# EAGLE design adc12 (EAGLE 7.2.0)
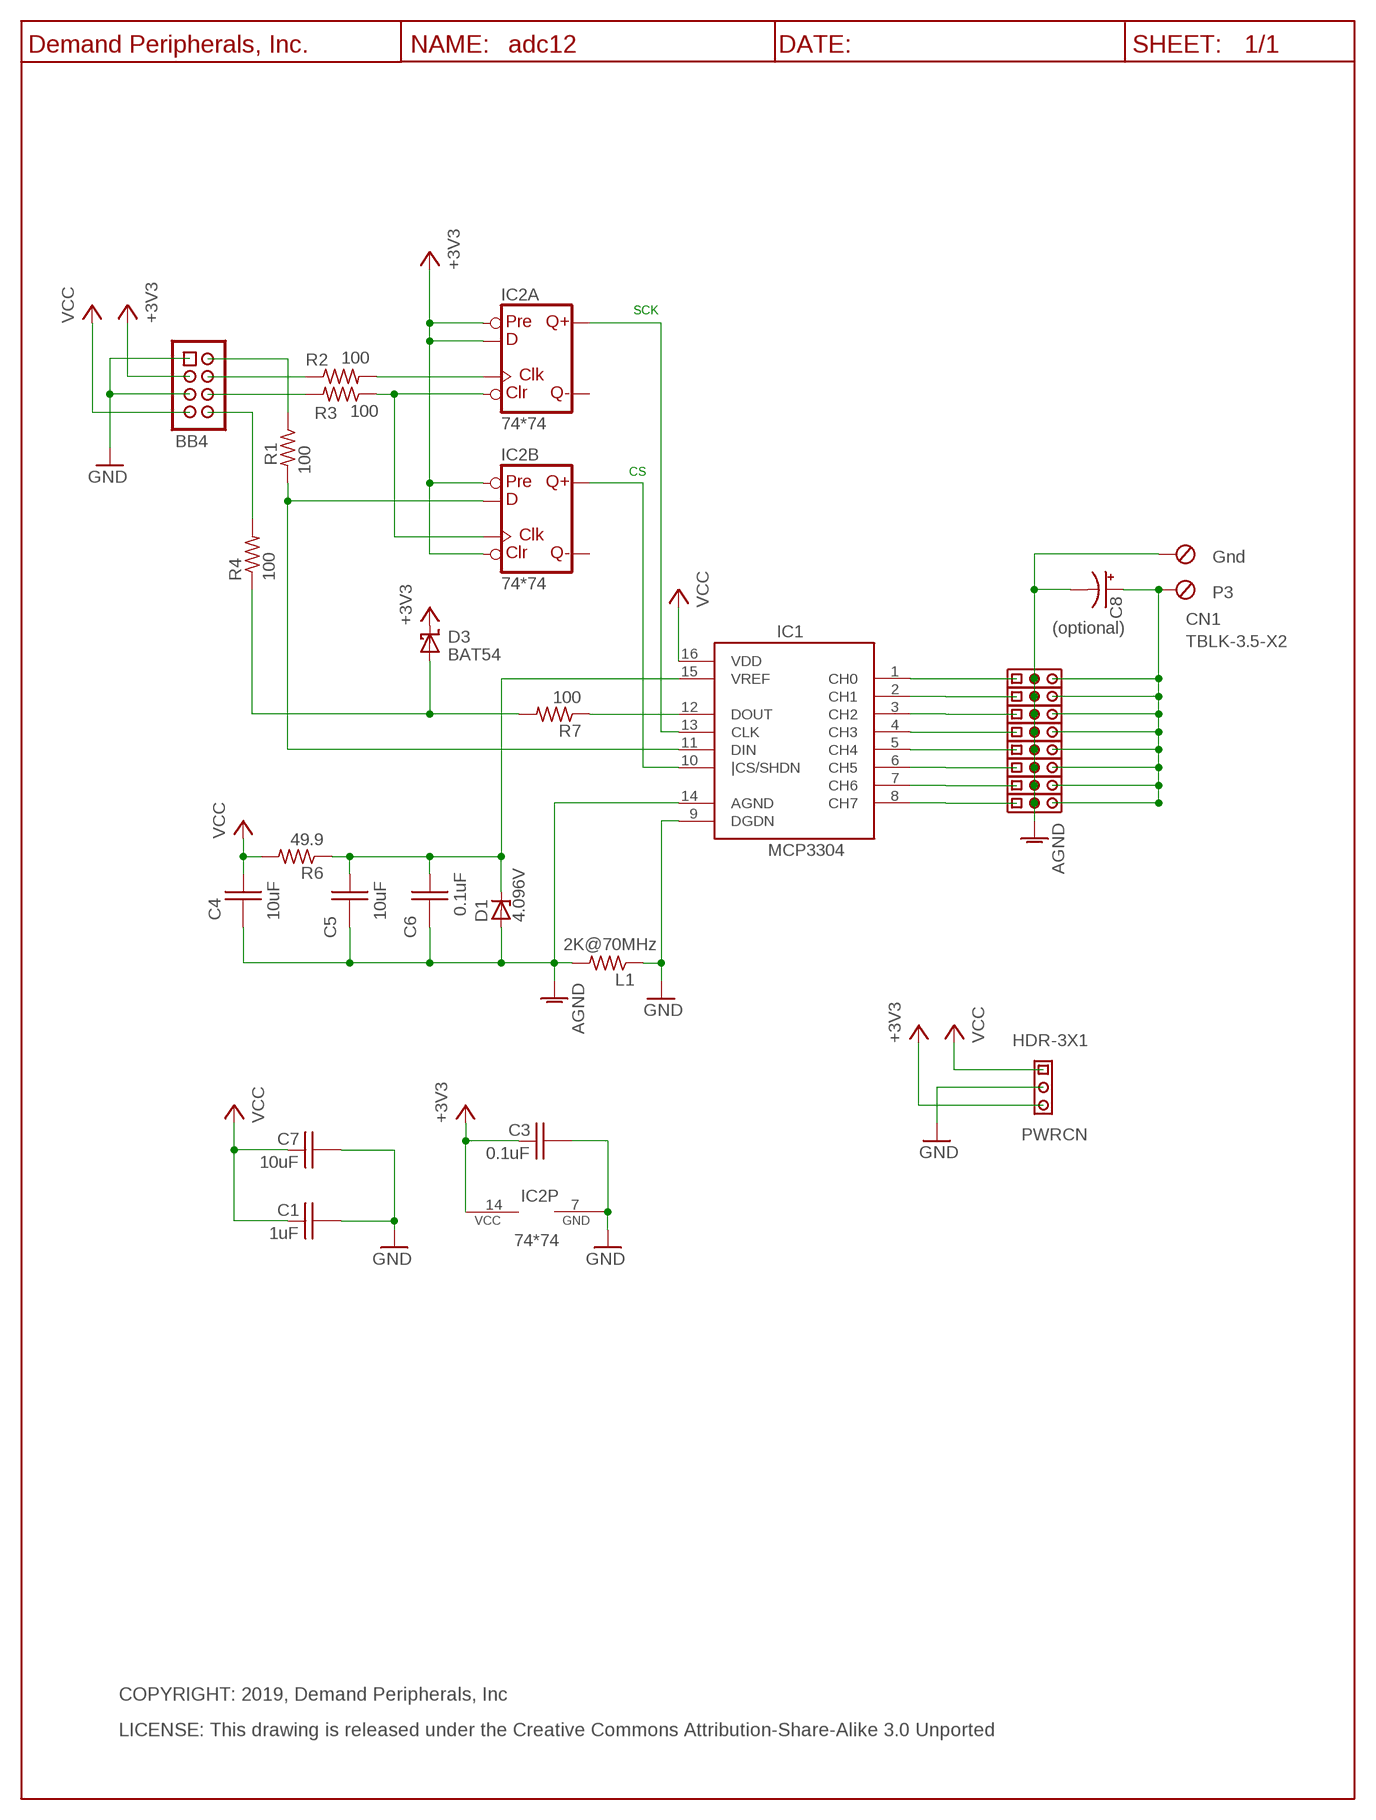
[diagram p0: schematic, sheet 1]

## Parts
BB4  BB4_CON  HDR-4X2-SHR  [HDR-4X2]
C1  1uF  C1.0UF_C0603  [C0603]
C3  0.1uF  C0.1UF_C0603  [C0603]
C4  10uF  C10UF35V_C0805  [C0805]
C5  10uF  C10UF35V_C0805  [C0805]
C6  0.1uF  C0.1UF_C0603  [C0603]
C7  10uF  C10UF35V_C0805  [C0805]
C8  C100UF_E3.5-8  [E3.5-8]
CN1  TBLK-3.5-X2  [TBLK-3.5-X2]
D1  4.096V  LM4040  [SOT23]
D3  BAT54  [SOT23]
IC1  MCP3304  [SO16]
IC2  74*74  74AHC74SS  [SO14]
L1  2K@70MHz  L2K70MHZR0805  [R0805]
PWRCN  HDR-3X1  [HDR-3X1]
R1  100  R100_R0603  [R0603]
R2  100  R100_R0603  [R0603]
R3  100  R100_R0603  [R0603]
R4  100  R100_R0603  [R0603]
R6  49.9  R49.9R0603  [R0603]
R7  100  R100_R0603  [R0603]
U$3  DP_FRAME_P  [LETTER_P]
U$6  HDR-3X1  [HDR-3X1]
U$7  HDR-3X1  [HDR-3X1]
U$8  HDR-3X1  [HDR-3X1]
U$9  HDR-3X1  [HDR-3X1]
U$10  HDR-3X1  [HDR-3X1]
U$11  HDR-3X1  [HDR-3X1]
U$12  HDR-3X1  [HDR-3X1]
U$13  HDR-3X1  [HDR-3X1]

## Nets
+3V3: BB4.3 C3.1 D3.3(CC) IC2.2(A:D) IC2.4(A:PRE) IC2.10(B:PRE) IC2.13(B:CLR) IC2.14(P:VCC) PWRCN.3
AGND: C4.2 C5.2 C6.2 C8.- CN1.1(KL) D1.2(A) IC1.14(AGND) L1.2 U$6.2 U$7.2 U$8.2 U$9.2 U$10.2 U$11.2 U$12.2 U$13.2
GND: BB4.1 BB4.5 C1.2 C3.2 C7.2 IC1.9(DGDN) IC2.7(P:GND) L1.1 PWRCN.2
N$1: C8.+ CN1.2(KL1) U$6.3 U$7.3 U$8.3 U$9.3 U$10.3 U$11.3 U$12.3 U$13.3
N$2: IC1.2(CH1) U$12.1
N$3: IC1.3(CH2) U$11.1
N$4: IC1.4(CH3) U$10.1
N$5: IC1.5(CH4) U$9.1
N$6: IC1.6(CH5) U$8.1
N$7: IC1.7(CH6) U$7.1
N$8: IC1.8(CH7) U$6.1
N$9: IC1.12(DOUT) R7.1
N$10: IC1.1(CH0) U$13.1
N$11: D3.1(A) R4.1 R7.2
N$13: IC2.1(A:CLR) IC2.11(B:CLK) R3.1
N$14: BB4.4 R2.1
N$15: IC1.11(DIN) IC2.12(B:D) R1.2
N$16: IC2.3(A:CLK) R2.2
N$17: IC1.10(|CS/SHDN) IC2.9(B:Q)
N$18: IC1.13(CLK) IC2.5(A:Q)
N$19: BB4.6 R3.2
N$20: BB4.2 R1.1
N$21: BB4.8 R4.2
N$23: C5.1 C6.1 D1.1(C) IC1.15(VREF) R6.1
VCC: BB4.7 C1.1 C4.1 C7.1 IC1.16(VDD) PWRCN.1 R6.2
Unconnected: IC2.6(A:!Q) IC2.8(B:!Q)

## Notes on the sheet
- SCK
- CS
- Gnd
- P3
- (optional)
- COPYRIGHT: 2019, Demand Peripherals, Inc
- LICENSE: This drawing is released under the Creative Commons Attribution-Share-Alike 3.0 Unported

## Library data of the parts
BB4 = dpi-conn:HDR-4X2-SHR: Shrouded 4x2 pin header; VENDOR: Digikey; VENDOR-PART-NUM: 609-3530-ND
C1 = dpi-passive:C1.0UF_: 1.0 uF Capacitor, 25V, Y5V; VENDOR: Digikey; VENDOR-PART-NUM: 490-3897-2-ND
C3 C6 = dpi-passive:C0.1UF_: 0.1 uF Capacitor, 25V, X7R; VENDOR: Digikey; VENDOR-PART-NUM: 1276-1126-2-ND
C4 C5 C7 = dpi-passive:C10UF35V_: 10 uF Capacitor, 35V, X6S; VENDOR: Digikey; VENDOR-PART-NUM: 490-10504-2-ND
C8 = dpi-passive:C100UF_: 100uF polarized capacitor, general purpose; VENDOR: Digikey; VENDOR-PART-NUM: 1572-1044-ND
CN1 = dpi-conn:TBLK-3.5-X2: Terminal Block, 3.5mm, x2, screw terminals; VENDOR: Digikey; VENDOR-PART-NUM: ED2740-ND
D1 = dpi-diopto:LM4040: Zener Diode, 4.096 volts, +/-0.2%; VENDOR: Digikey; VENDOR-PART-NUM: LM4040BIM3-4.1/NOPBCT-ND
D3 = dpi-diopto:BAT54: Schottky Diode; VENDOR: Digikey; VENDOR-PART-NUM: DB3Y313KELCT-ND
IC1 = dpi-transic:MCP3304: 8 channel ADC converter with SPI interface; VENDOR: Digikey; VENDOR-PART-NUM: MCP3304-CI/SL-ND
IC2 = dpi-transic:74AHC74: Dual D type positive edge triggered FLIP FLOP, preset and clear; VENDOR: Digikey; VENDOR-PART-NUM: 568-4458-1-ND
L1 = dpi-passive:L2K70MHZ: Ferrite filter, 2K Ohm at 70MHz; VENDOR: Digikey; VENDOR-PART-NUM: 1276-6330-1-ND
PWRCN U$6-U$13 = dpi-conn:HDR-3X1: 3 pin header on 0.1 inch centers, no shroud, no lock; VENDOR: Digikey; VENDOR-PART-NUM: 952-2264-ND
R1-R4 R7 = dpi-passive:R100_: 100 Ohm resistor, 1%, 0.1 watt; VENDOR: Digikey; VENDOR-PART-NUM: 311-100HRTR-ND
R6 = dpi-passive:R49.9: 49.9 Ohm resistor, 1%, 0.1 watt; VENDOR: Digikey; VENDOR-PART-NUM: 311-49.9HRTR-ND
U$3 = DP:DP_FRAME_P: Portrait/Letter Document Frame

## Board
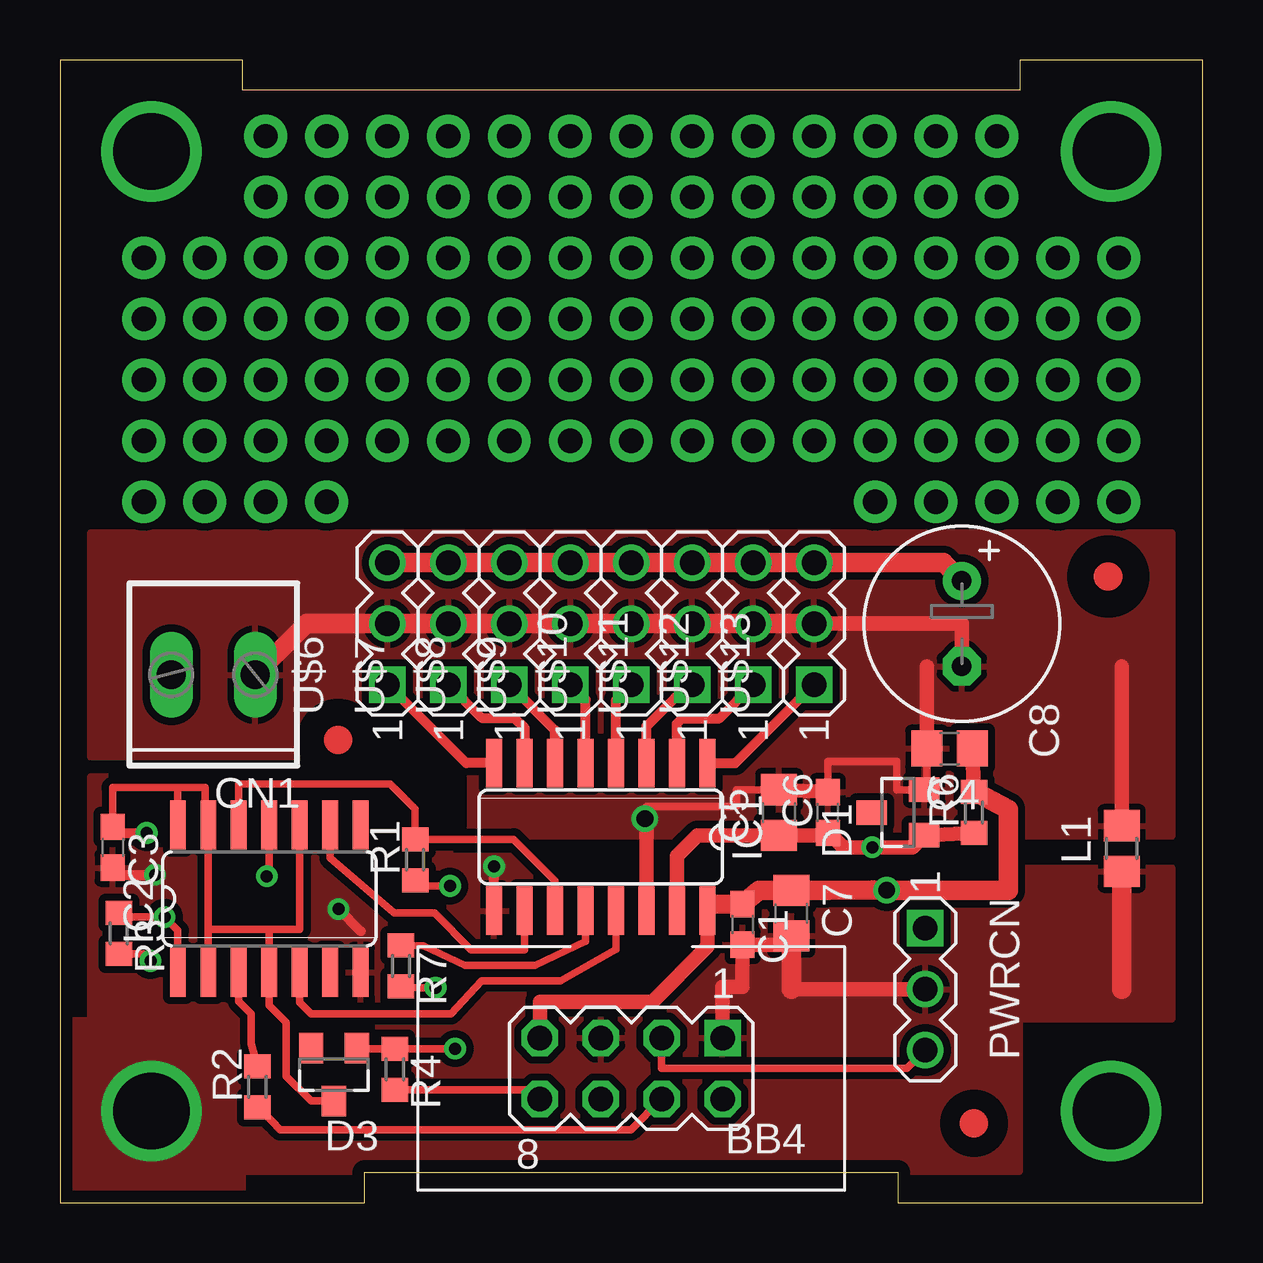
[diagram p1: board, top side]
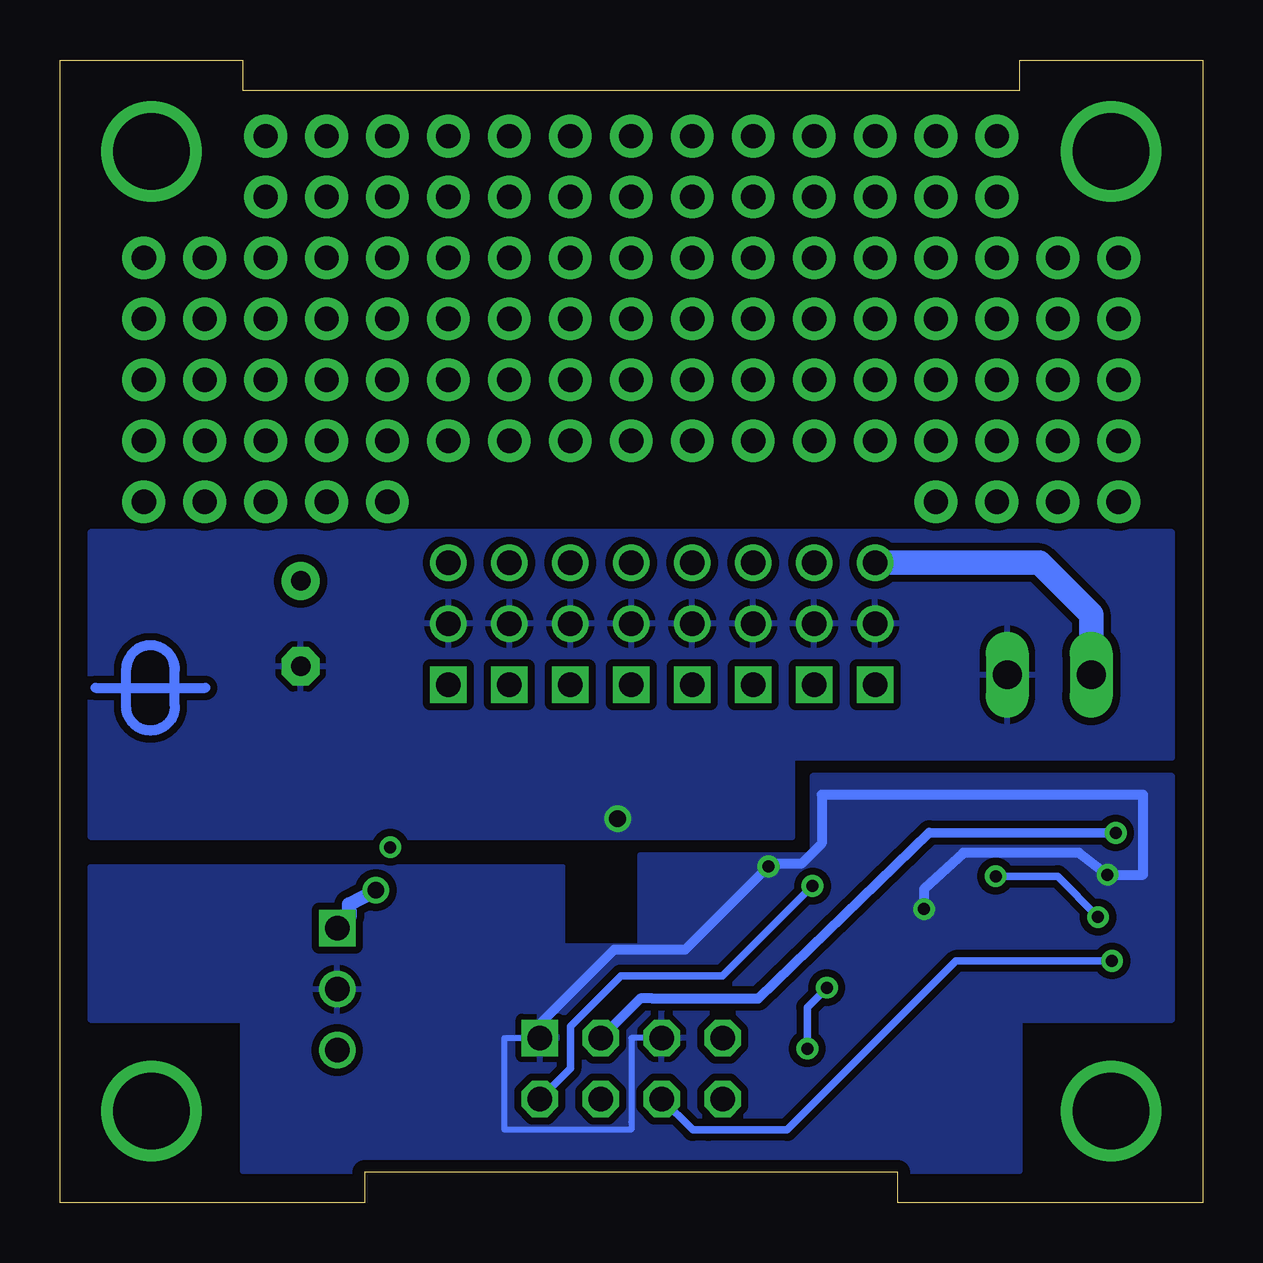
[diagram p2: board, bottom side, seen from below]

Size 47.62 x 47.62 mm. Coordinates in mm from the lower left corner, seen from the top.
Outline: 0,0 12.7,0 12.7,1.27 34.92,1.27 34.92,0 47.62,0 47.62,47.62 40.01,47.62 40.01,46.35 7.62,46.35 7.62,47.62 0,47.62 0,0
Copper layers (1*16): Top 0.035mm / dielectric 1.5mm / Bottom 0.035mm
Design rules "default *": minimum track width 10mil, minimum drill 19mil, track to track 12mil, track to pad 12mil, pad to pad 12mil, via to via 12mil, smd to smd 10mil, copper to edge 20mil, drill to drill 12mil, minimum pad ring 10mil, minimum via ring 8mil, stop-mask expansion 4mil, vias tented up to drill 0mil, thermal gap 10mil
tKeepout: area 15.1,1 to 32.5,9.7

### Footprints (pad centres in the part's own frame; a part is rotated, then mirrored left to right if it is on the bottom)
HDR-4X2 = drill 1.016 square: 1 -3.81,-1.27 | drill 1.016 octagon: 2 -3.81,1.27; 3 -1.27,-1.27; 4 -1.27,1.27; 5 1.27,-1.27; 6 1.27,1.27; 7 3.81,-1.27; 8 3.81,1.27
C0603 = smd 1.1 x 1: 1 -0.85,0; 2 0.85,0
C0805 = smd 1.3 x 1.5: 1 -0.95,0; 2 0.95,0
E3.5-8 = drill 0.813 pad 1.6: + -1.778,0 | drill 0.813 pad 1.6 octagon: - 1.778,0
TBLK-3.5-X2 = drill 1.2 long: 1 -1.75,0; 2 1.75,0
SOT23 = smd 1.016 x 1.27: 1 -0.95,-1.1; 2 0.95,-1.1; 3 0,1.1
SO16 = smd 0.66 x 2.032: 1 -4.445,-3.073; 2 -3.175,-3.073; 3 -1.905,-3.073; 4 -0.635,-3.073; 5 0.635,-3.073; 6 1.905,-3.073; 7 3.175,-3.073; 8 4.445,-3.073; 9 4.445,3.073; 10 3.175,3.073; 11 1.905,3.073; 12 0.635,3.073; 13 -0.635,3.073; 14 -1.905,3.073; 15 -3.175,3.073; 16 -4.445,3.073
SO14 = smd 0.66 x 2.032: 1 -3.81,-3.073; 2 -2.54,-3.073; 3 -1.27,-3.073; 4 0,-3.073; 5 1.27,-3.073; 6 2.54,-3.073; 7 3.81,-3.073; 8 3.81,3.073; 9 2.54,3.073; 10 1.27,3.073; 11 0,3.073; 12 -1.27,3.073; 13 -2.54,3.073; 14 -3.81,3.073
R0805 = smd 1.3 x 1.5: 1 -0.95,0; 2 0.95,0
HDR-3X1 = drill 1.016 square: 1 -2.54,0 | drill 1.016: 2 0,0; 3 2.54,0
R0603 = smd 1 x 1.1: 1 -0.85,0; 2 0.85,0

### Placement (x,y rotation side)
BB4  23.81,5.59 180 top
C1  28.45,11.6 270 top
C3  2.2,14.81 270 top
C4  37.08,18.92 180 top
C5  29.97,16.26 90 top
C6  32,16.26 90 top
C7  30.48,12.06 270 top
C8  37.59,24.13 270 top
CN1  6.39,22 180 top
D1  34.92,16.26 90 top
D3  11.42,5.33 180 top
IC1  22.54,15.24 180 top
IC2  8.72,12.66 0 top
L1  44.26,14.76 90 top
PWRCN  36.07,8.89 270 top
R1  14.81,14.29 90 top
R2  8.23,4.83 90 top
R3  2.45,11.21 270 top
R4  13.96,5.55 270 top
R6  38.1,16.26 90 top
R7  14.21,9.87 270 top
U$1  [DPI-1]  43.85,21.45 90 bottom
U$2  [FIDUCIAL]  11.6,19.28 0 top
U$3  -2.54,-2.54 0 top
U$4  [FIDUCIAL]  43.69,26.09 0 top
U$5  [FIDUCIAL]  38.1,3.3 0 top
U$6  13.65,24.13 90 top
U$7  16.19,24.13 90 top
U$8  18.73,24.13 90 top
U$9  21.27,24.13 90 top
U$10  23.81,24.13 90 top
U$11  26.35,24.13 90 top
U$12  28.89,24.13 90 top
U$13  31.43,24.13 90 top

### Tracks (layer width: path | path; a pad name or v marks a point on that pad's centre or on a via)
+3V3  (via drill 0.5)
  Top 0.305: 8.72,11.39 IC2.4 8.72,8.21 9.42,7.51 9.42,5.27 10.46,4.23 D3.3 | 8.72,11.39 6.18,11.39 | 6.18,11.39 IC2.2 | 6.18,11.39 IC2.13 6.12,15.8 6.06,15.73 6.06,17.3 4.92,17.3 | IC2.10 9.99,11.39 8.72,11.39 | 4.92,17.3 4.84,17.3 | 4.84,17.3 2.2,17.3 C3.1 | IC2.14 4.92,17.3 | 4.92,17.3 4.84,17.3 | PWRCN.3 35.31,5.59 27.06,5.59 25.08,5.59 BB4.3
  Top 0.406: C3.1 2.45,15.4 v3.62,15.4
  Bottom 0.406: v3.62,15.4 11.39,15.42 18.52,8.51 22.92,8.51 23.43,8.51 BB4.3
AGND  (via drill 0.7)
  Top 0.305: C5.2 28.19,17.21 28.19,16.51 24.45,16.51 24.45,15.82 | C4.2 36.13,17.21 D1.2 34.89,17.21 34.89,18.39 32,18.39 C6.2
  Top 0.61: C6.2 C5.2 | 36.13,22.35 C4.2 | 44.26,22.35 L1.2 | 24.45,15.82 IC1.14 | U$13.2 37.59,24.13 C8.-
  Top 0.813: U$13.2 U$12.2 U$11.2 U$10.2 U$9.2 U$8.2 U$7.2 U$6.2 10.27,24.13 CN1.1
  other vias: 24.38,16
  pour Top (isolate 0.305): 46.35,27.94 46.35,15.24 17.09,15.23 17.09,18.54 1.27,18.54 1.27,27.94
  pour Bottom (isolate 0.305): 46.35,27.94 46.35,15.24 17.09,15.23 17.09,18.54 1.27,18.54 1.27,27.94
GND  (via drill 0.5, 3.17)
  Top 0.406: IC1.9 v18.1,14.01 | v11.61,12.23 12.54,11.3 | 2.49,13.66 v3.96,13.66
  Top 0.61: C7.2 30.43,10.73 C1.2 28.45,8.99 27.62,8.99 BB4.1 | PWRCN.2 30.48,8.89
  Top 0.813: C7.2 30.48,8.89 | 44.26,8.89 L1.1
  Bottom 0.254: BB4.5 23.81,6.86 23.81,3.35 23.81,3.04 29.1,3.04 29.1,6.86 BB4.1
  Bottom 0.406: v18.1,14.01 21.57,10.54 24.52,10.54 27.62,7.44 BB4.1 | v11.61,12.23 11.61,13.07 9.97,14.58 5.16,14.58 v3.96,13.66 2.48,13.66 2.48,16.99 15.88,16.99 15.88,14.97 16.73,14.12 17.98,14.12 v18.1,14.01 | 18.1,13.97 v18.1,14.01
  other vias: 3.81,3.81
  pour Bottom (isolate 0.305): 1.27,7.62 1.27,17.78 16.26,17.78 16.26,14.48 23.44,14.48 23.44,10.67 26.67,10.67 26.67,13.97 46.35,13.97 46.35,7.62 40.01,7.62 40.01,1.32 7.62,1.32 7.62,7.62
  pour Top: 1.27,17.78 16.26,17.78 16.26,14.48 23.51,14.48 23.51,10.67 26.67,10.67 26.67,13.97 46.35,13.97 46.35,7.62 40.01,7.62 40.01,1.27 7.62,1.27 7.62,0.51 0.51,0.51 0.51,7.62 1.27,7.62
MOUNT2  (via drill 3.17)
  other vias: 43.81,43.81
MOUNT3  (via drill 3.17)
  other vias: 43.81,3.81
MOUNT4  (via drill 3.17)
  other vias: 3.81,43.81
N$1
  Top 0.813: U$6.3 U$7.3 U$8.3 U$9.3 U$10.3 U$11.3 U$12.3 U$13.3 36.83,26.67 C8.+
  Bottom 1.016: U$6.3 6.81,26.67 4.64,24.5 CN1.2
N$2
  Top 0.406: IC1.2 25.72,19.96 25.93,20.18 27.48,20.18 U$12.1
N$3
  Top 0.406: IC1.3 24.45,19.85 25.65,21.06 26.19,21.59 U$11.1
N$4
  Top 0.406: IC1.4 23.18,20.95 U$10.1
N$5
  Top 0.406: IC1.5 21.91,20.95 U$9.1
N$6
  Top 0.406: IC1.6 20.64,19.68 U$8.1
N$7
  Top 0.406: IC1.7 19.37,19.77 18.94,20.21 17.58,20.21 U$7.1
N$8
  Top 0.406: IC1.8 16.93,18.31 U$6.1
N$9
  Top 0.305: IC1.12 21.91,10.88 19.8,9.88 16.88,9.88 15.15,10.71 R7.1
N$10
  Top 0.406: IC1.1 28.16,18.31 U$13.1
N$11  (via drill 0.5)
  Top 0.305: D3.1 12.4,6.4 R4.1 16.46,6.4 v16.47,6.41 | R7.2 14.9,8.95 v15.66,8.95
  Bottom 0.305: v15.66,8.95 16.47,8.14 v16.47,6.41
N$13  (via drill 0.5)
  Top 0.305: IC2.11 8.72,13.93 v8.62,13.6 | R3.1 2.62,11.9 v4.36,11.9 4.92,11.34 IC2.1
  Bottom 0.305: v8.62,13.6 6.03,13.6 v4.36,11.9
N$14
  Top 0.305: R2.1 8.84,3.38 9.18,3.04 9.93,3.04 23.8,3.04 BB4.4
N$15
  Top 0.305: IC1.11 20.64,13.41 18.91,15.14 R1.2 14.81,16.41 13.77,17.45 7.46,17.45 IC2.12
N$16
  Top 0.305: R2.2 7.98,6.62 7.98,7.86 7.46,8.38 IC2.3
N$17
  Top 0.305: IC2.9 11.27,14.36 13.93,12.06 15.61,12.08 17.14,10.54 18.67,10.54 19.37,10.53 IC1.10
N$18
  Top 0.305: IC1.13 23.18,10.55 20.87,9.23 17.58,9.23 16.29,7.87 10.46,7.87 9.99,8.34 IC2.5
N$19  (via drill 0.5)
  Top 0.305: R3.2 3.48,10.36 v3.77,10.07
  Bottom 0.305: v3.77,10.07 10.27,10.07 17.32,3.02 20.6,3.02 21.25,3.02 BB4.6
N$20  (via drill 0.5)
  Top 0.305: R1.1 15.05,13.2 v16.26,13.2
  Bottom 0.305: v16.26,13.2 20,9.45 24.24,9.45 26.35,7.34 26.35,5.59 BB4.2
N$21
  Top 0.305: BB4.8 19.62,4.7 R4.2
N$23  (via drill 0.5)
  Top 0.61: D1.1 R6.1 | IC1.15 25.72,14.45 26.57,15.31 C5.1 31.9,15.31 C6.1 32.07,15.41 32.66,14.81 v33.86,14.81 35.53,14.81 D1.1 | 35.69,15.1 D1.1
S$2
  Bottom 0.406: 28.92,21.59 29.22,21.59
VCC  (via drill 0.7)
  Top 0.406: IC1.16 arc8 27.2,12.43
  Top 0.61: R6.2 C4.1 | BB4.7 20,8.37 23.84,8.37 24.69,8.37 26.98,10.65 26.99,10.67 IC1.16
  Top 0.813: R6.2 38.15,17.11 39.52,16.4 39.52,14.11 39.52,13.02 v34.45,13.02 33.88,13.03 32.04,13.02 C7.1 29.14,13.02 C1.1 27.2,12.43
  Bottom 0.61: v34.45,13.02 35.57,12.42 35.56,11.94 PWRCN.1
WW4  (via drill 1.02 pad 1.78)
  other vias: 3.49,29.21
WW5  (via drill 1.02 pad 1.78)
  other vias: 3.49,31.75
WW6  (via drill 1.02 pad 1.78)
  other vias: 3.49,34.29
WW7  (via drill 1.02 pad 1.78)
  other vias: 3.49,36.83
WW8  (via drill 1.02 pad 1.78)
  other vias: 3.49,39.37
WW15  (via drill 1.02 pad 1.78)
  other vias: 6.03,29.21
WW16  (via drill 1.02 pad 1.78)
  other vias: 6.03,31.75
WW17  (via drill 1.02 pad 1.78)
  other vias: 6.03,34.29
WW18  (via drill 1.02 pad 1.78)
  other vias: 6.03,36.83
WW19  (via drill 1.02 pad 1.78)
  other vias: 6.03,39.37
WW26  (via drill 1.02 pad 1.78)
  other vias: 8.57,29.21
WW27  (via drill 1.02 pad 1.78)
  other vias: 8.57,31.75
WW28  (via drill 1.02 pad 1.78)
  other vias: 8.57,34.29
WW29  (via drill 1.02 pad 1.78)
  other vias: 8.57,36.83
WW30  (via drill 1.02 pad 1.78)
  other vias: 8.57,39.37
WW31  (via drill 1.02 pad 1.78)
  other vias: 8.57,41.91
WW32  (via drill 1.02 pad 1.78)
  other vias: 8.57,44.45
WW37  (via drill 1.02 pad 1.78)
  other vias: 11.11,29.21
WW38  (via drill 1.02 pad 1.78)
  other vias: 11.11,31.75
WW39  (via drill 1.02 pad 1.78)
  other vias: 11.11,34.29
WW40  (via drill 1.02 pad 1.78)
  other vias: 11.11,36.83
WW41  (via drill 1.02 pad 1.78)
  other vias: 11.11,39.37
WW42  (via drill 1.02 pad 1.78)
  other vias: 11.11,41.91
WW43  (via drill 1.02 pad 1.78)
  other vias: 11.11,44.45
WW49  (via drill 1.02 pad 1.78)
  other vias: 13.65,31.75
WW50  (via drill 1.02 pad 1.78)
  other vias: 13.65,34.29
WW51  (via drill 1.02 pad 1.78)
  other vias: 13.65,36.83
WW52  (via drill 1.02 pad 1.78)
  other vias: 13.65,39.37
WW53  (via drill 1.02 pad 1.78)
  other vias: 13.65,41.91
WW54  (via drill 1.02 pad 1.78)
  other vias: 13.65,44.45
WW60  (via drill 1.02 pad 1.78)
  other vias: 16.19,31.75
WW61  (via drill 1.02 pad 1.78)
  other vias: 16.19,34.29
WW62  (via drill 1.02 pad 1.78)
  other vias: 16.19,36.83
WW63  (via drill 1.02 pad 1.78)
  other vias: 16.19,39.37
WW64  (via drill 1.02 pad 1.78)
  other vias: 16.19,41.91
WW65  (via drill 1.02 pad 1.78)
  other vias: 16.19,44.45
WW71  (via drill 1.02 pad 1.78)
  other vias: 18.73,31.75
WW72  (via drill 1.02 pad 1.78)
  other vias: 18.73,34.29
WW73  (via drill 1.02 pad 1.78)
  other vias: 18.73,36.83
WW74  (via drill 1.02 pad 1.78)
  other vias: 18.73,39.37
WW75  (via drill 1.02 pad 1.78)
  other vias: 18.73,41.91
WW76  (via drill 1.02 pad 1.78)
  other vias: 18.73,44.45
WW82  (via drill 1.02 pad 1.78)
  other vias: 21.27,31.75
WW83  (via drill 1.02 pad 1.78)
  other vias: 21.27,34.29
WW84  (via drill 1.02 pad 1.78)
  other vias: 21.27,36.83
WW85  (via drill 1.02 pad 1.78)
  other vias: 21.27,39.37
WW86  (via drill 1.02 pad 1.78)
  other vias: 21.27,41.91
WW87  (via drill 1.02 pad 1.78)
  other vias: 21.27,44.45
WW93  (via drill 1.02 pad 1.78)
  other vias: 23.81,31.75
WW94  (via drill 1.02 pad 1.78)
  other vias: 23.81,34.29
WW95  (via drill 1.02 pad 1.78)
  other vias: 23.81,36.83
WW96  (via drill 1.02 pad 1.78)
  other vias: 23.81,39.37
WW97  (via drill 1.02 pad 1.78)
  other vias: 23.81,41.91
WW98  (via drill 1.02 pad 1.78)
  other vias: 23.81,44.45
WW104  (via drill 1.02 pad 1.78)
  other vias: 26.35,31.75
WW105  (via drill 1.02 pad 1.78)
  other vias: 26.35,34.29
WW106  (via drill 1.02 pad 1.78)
  other vias: 26.35,36.83
WW107  (via drill 1.02 pad 1.78)
  other vias: 26.35,39.37
WW108  (via drill 1.02 pad 1.78)
  other vias: 26.35,41.91
WW109  (via drill 1.02 pad 1.78)
  other vias: 26.35,44.45
WW115  (via drill 1.02 pad 1.78)
  other vias: 28.89,31.75
WW116  (via drill 1.02 pad 1.78)
  other vias: 28.89,34.29
WW117  (via drill 1.02 pad 1.78)
  other vias: 28.89,36.83
WW118  (via drill 1.02 pad 1.78)
  other vias: 28.89,39.37
WW119  (via drill 1.02 pad 1.78)
  other vias: 28.89,41.91
WW120  (via drill 1.02 pad 1.78)
  other vias: 28.89,44.45
WW126  (via drill 1.02 pad 1.78)
  other vias: 31.43,31.75
WW127  (via drill 1.02 pad 1.78)
  other vias: 31.43,34.29
WW128  (via drill 1.02 pad 1.78)
  other vias: 31.43,36.83
WW129  (via drill 1.02 pad 1.78)
  other vias: 31.43,39.37
WW130  (via drill 1.02 pad 1.78)
  other vias: 31.43,41.91
WW131  (via drill 1.02 pad 1.78)
  other vias: 31.43,44.45
WW136  (via drill 1.02 pad 1.78)
  other vias: 33.97,29.21
WW137  (via drill 1.02 pad 1.78)
  other vias: 33.97,31.75
WW138  (via drill 1.02 pad 1.78)
  other vias: 33.97,34.29
WW139  (via drill 1.02 pad 1.78)
  other vias: 33.97,36.83
WW140  (via drill 1.02 pad 1.78)
  other vias: 33.97,39.37
WW141  (via drill 1.02 pad 1.78)
  other vias: 33.97,41.91
WW142  (via drill 1.02 pad 1.78)
  other vias: 33.97,44.45
WW147  (via drill 1.02 pad 1.78)
  other vias: 36.51,29.21
WW148  (via drill 1.02 pad 1.78)
  other vias: 36.51,31.75
WW149  (via drill 1.02 pad 1.78)
  other vias: 36.51,34.29
WW150  (via drill 1.02 pad 1.78)
  other vias: 36.51,36.83
WW151  (via drill 1.02 pad 1.78)
  other vias: 36.51,39.37
WW152  (via drill 1.02 pad 1.78)
  other vias: 36.51,41.91
WW153  (via drill 1.02 pad 1.78)
  other vias: 36.51,44.45
WW158  (via drill 1.02 pad 1.78)
  other vias: 39.05,29.21
WW159  (via drill 1.02 pad 1.78)
  other vias: 39.05,31.75
WW160  (via drill 1.02 pad 1.78)
  other vias: 39.05,34.29
WW161  (via drill 1.02 pad 1.78)
  other vias: 39.05,36.83
WW162  (via drill 1.02 pad 1.78)
  other vias: 39.05,39.37
WW163  (via drill 1.02 pad 1.78)
  other vias: 39.05,41.91
WW164  (via drill 1.02 pad 1.78)
  other vias: 39.05,44.45
WW169  (via drill 1.02 pad 1.78)
  other vias: 41.59,29.21
WW170  (via drill 1.02 pad 1.78)
  other vias: 41.59,31.75
WW171  (via drill 1.02 pad 1.78)
  other vias: 41.59,34.29
WW172  (via drill 1.02 pad 1.78)
  other vias: 41.59,36.83
WW173  (via drill 1.02 pad 1.78)
  other vias: 41.59,39.37
WW180  (via drill 1.02 pad 1.78)
  other vias: 44.13,29.21
WW181  (via drill 1.02 pad 1.78)
  other vias: 44.13,31.75
WW182  (via drill 1.02 pad 1.78)
  other vias: 44.13,34.29
WW183  (via drill 1.02 pad 1.78)
  other vias: 44.13,36.83
WW184  (via drill 1.02 pad 1.78)
  other vias: 44.13,39.37

### Text on the board
tTest: 1.875 Inches | 1.575 Inches | ADC812, Rev 19A | 8 | 7 | 6 | 5 | 4 | 3 | 2 | 1 | P3 | Gnd | + | C8 | C4 | IC1 | C5 | C6 | D1 | C3 | R1 | R6 | 1.575 Inches | 1.875 Inches | L1 | C1 | IC2 | C7 | 5 | R7 | R3 | G | 3 | (C) 2019, Demand Peripherals, Inc. | R4 | R2 | D2 | BB4